# EAGLE design power_board (EAGLE 9.5.1)
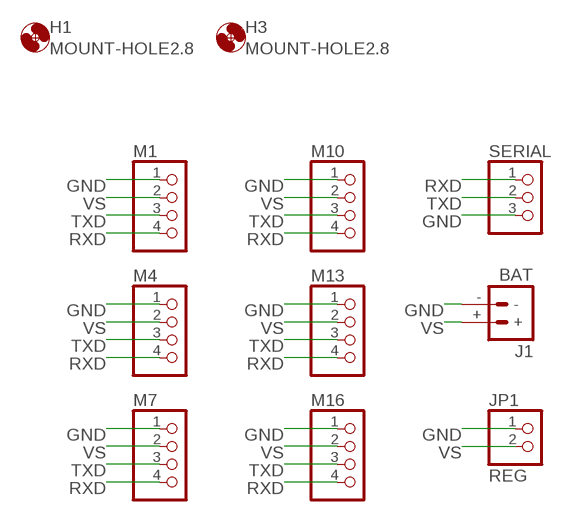
[diagram p0: schematic, sheet 1]

## Parts
H1  MOUNT-HOLE2.8  [2,8]
H3  MOUNT-HOLE2.8  [2,8]
J1  BAT  BATTERY_CONN_DEANS  [DEANS]
JP1  REG  PINHD-1X2  [1X02]
M1  PINHD-1X4  [1X04]
M4  PINHD-1X4  [1X04]
M7  PINHD-1X4  [1X04]
M10  PINHD-1X4  [1X04]
M13  PINHD-1X4  [1X04]
M16  PINHD-1X4  [1X04]
SERIAL  PINHD-1X3  [1X03]

## Nets
GND: J1.- JP1.1 M1.1 M4.1 M7.1 M10.1 M13.1 M16.1 SERIAL.3
RXD: M1.4 M4.4 M7.4 M10.4 M13.4 M16.4 SERIAL.1
TXD: M1.3 M4.3 M7.3 M10.3 M13.3 M16.3 SERIAL.2
VS: J1.+ JP1.2 M1.2 M4.2 M7.2 M10.2 M13.2 M16.2

## Library data of the parts
H1 H3 = holes:MOUNT-HOLE: MOUNTING HOLE with drill center marker
J1 = SparkFun-Connectors:BATTERY_CONN: Battery Connectors Various footprints for battery connections SparkFun Products: Deans Connector -M/F Pair <https://www.sparkfun.com/products/11864>; SF_ID: PRT-11864
JP1 = pinhead:PINHD-1X2: PIN HEADER
M1 M4 M7 M10 M13 M16 = pinhead:PINHD-1X4: PIN HEADER
SERIAL = pinhead:PINHD-1X3: PIN HEADER

## Board
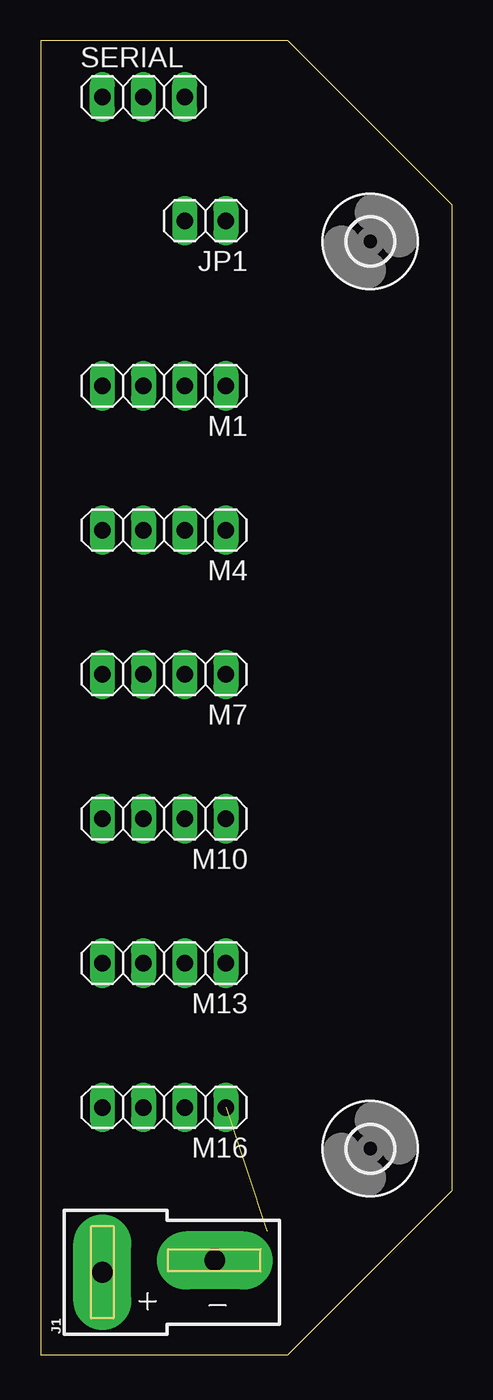
[diagram p1: board, top side]
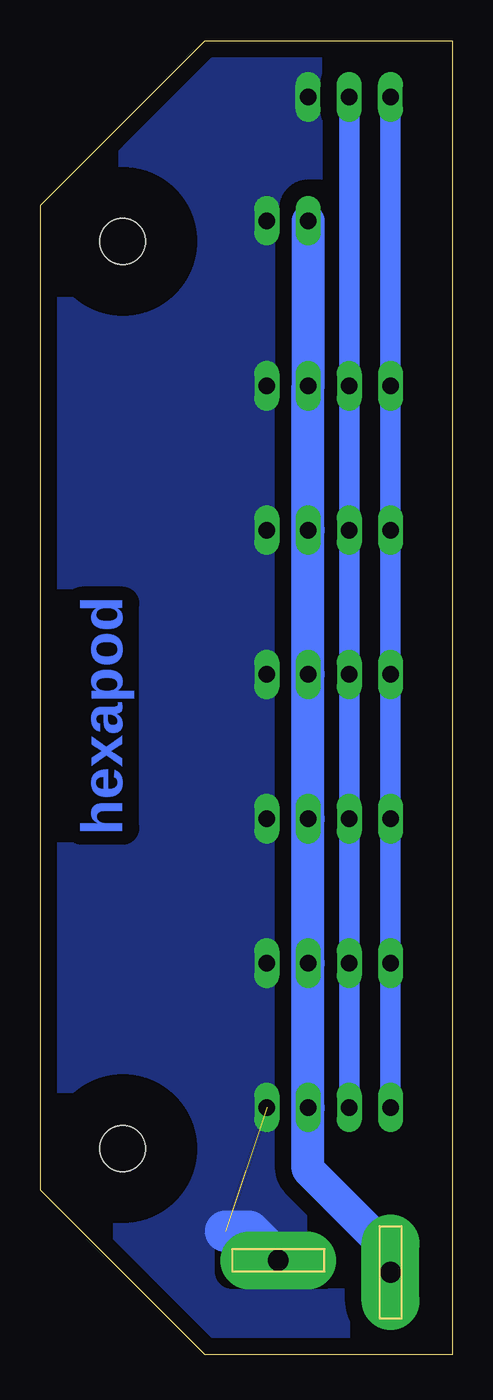
[diagram p2: board, bottom side, seen from below]

Size 25.38 x 80.95 mm. Coordinates in mm from the lower left corner, seen from the top.
Outline: 0,0 15.24,0 25.38,10.14 25.38,70.81 15.24,80.95 0,80.95 0,0
Copper layers (1*16): Top 0.035mm / dielectric 1.5mm / Bottom 0.035mm
Design rules "default *": minimum track width 0.8mm, minimum drill 1mm, track to track 0.7mm, track to pad 0.7mm, pad to pad 0.7mm, via to via 0.7mm, smd to smd 0.7mm, copper to edge 40mil, drill to drill 6mil, minimum pad ring 10mil, minimum via ring 8mil, stop-mask expansion 4mil, vias tented up to drill 0mil, thermal gap 10mil

### Footprints (pad centres in the part's own frame; a part is rotated, then mirrored left to right if it is on the bottom)
2,8 = hole 2.8: 0,0
DEANS = drill 1.27 pad 3.556 long: + 0,0; - 0.737,-6.921
1X02 = drill 1.016 long: 1 -1.27,0; 2 1.27,0
1X04 = drill 1.016 long: 1 -3.81,0; 2 -1.27,0; 3 1.27,0; 4 3.81,0
1X03 = drill 1.016 long: 1 -2.54,0; 2 0,0; 3 2.54,0

### Placement (x,y rotation side)
H1  20.32,12.7 0 top
H3  20.32,68.58 0 top
J1  3.81,5.08 90 top
JP1  10.16,69.85 180 top
M1  7.62,59.69 180 top
M4  7.62,50.8 180 top
M7  7.62,41.91 180 top
M10  7.62,33.02 180 top
M13  7.62,24.13 180 top
M16  7.62,15.24 180 top
SERIAL  6.35,77.47 0 top

### Tracks (layer width: path | path; a pad name or v marks a point on that pad's centre or on a via)
GND  (1 unrouted)
  Bottom 2.54: J1.- 12.54,7.62 13.97,7.62
  pour Bottom (isolate 1.016, no thermals): 1.27,80.01 1.27,1.27 15.24,1.27 24.13,10.16 24.13,71.12 15.24,80.01
RXD
  Bottom 1.27: SERIAL.1 M1.4 M4.4 M7.4 M10.4 M13.4 M16.4
TXD
  Bottom 1.27: M16.3 M13.3 M10.3 M7.3 M4.3 M1.3 SERIAL.2
VS
  Bottom 2.032: J1.+ 3.81,6.35 8.89,11.43 M16.2 M13.2 M10.2 M7.2 M4.2 M1.2 JP1.2

### Text on the board
Bottom: hexapod